# Altium schematic sheet RPi_SyncInputAdapter_Schematic.SchDoc
size A; Organization: Altium Limited; Address1: L3, 12a Rodborough Rd; Address2: Frenchs Forest; Address3: NSW; Address4: Australia 2086
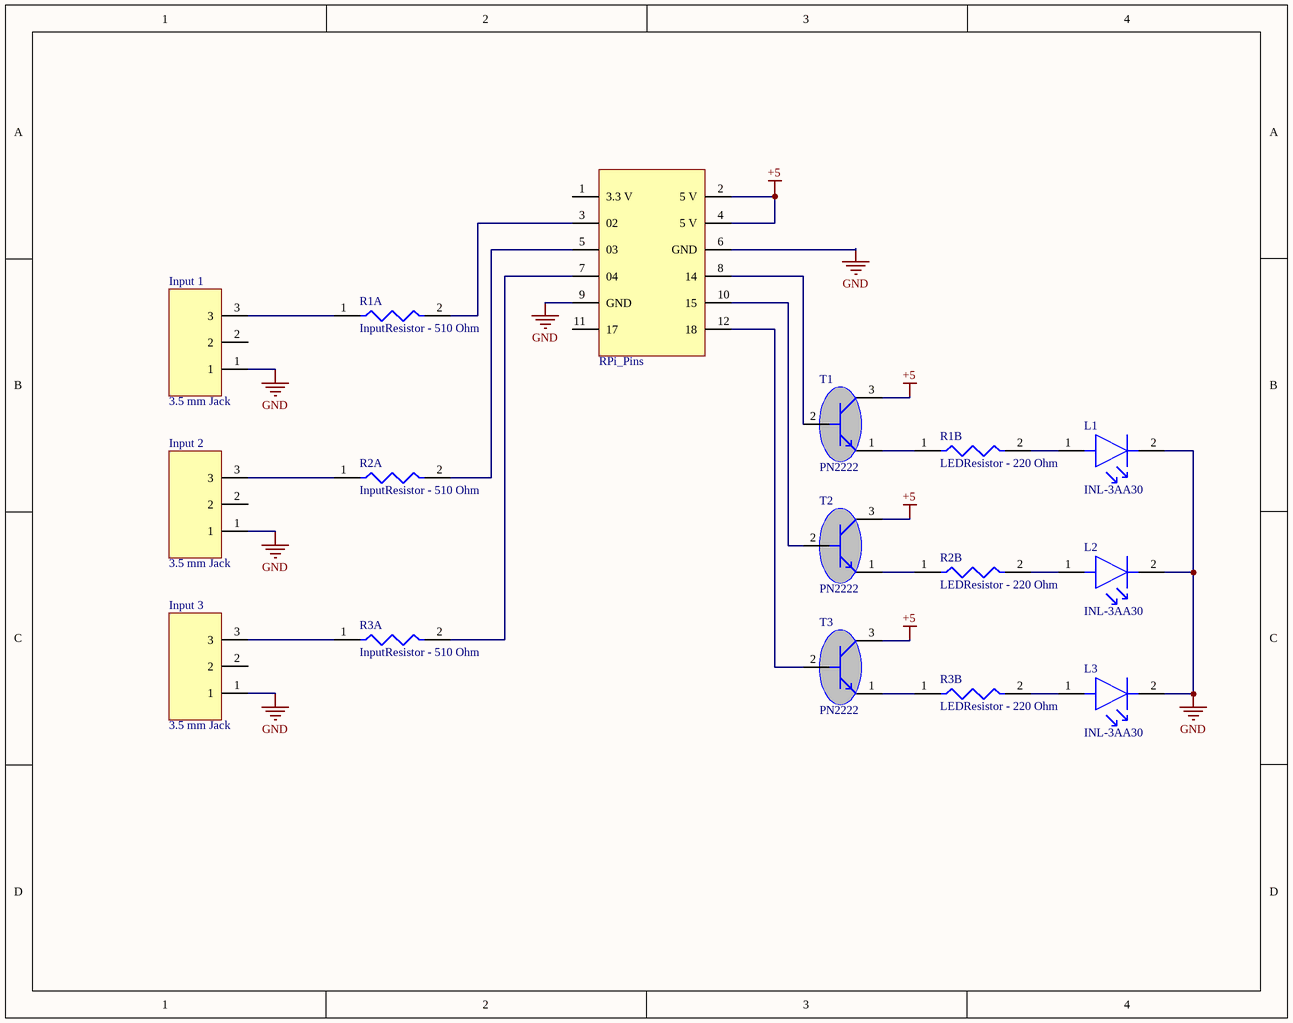
[diagram p0: RPi_SyncInputAdapter_Schematic.SchDoc]

## Parts
*  RPi_Pins  [RPi_Interface]
Input_1  3.5 mm Jack  [3PolesAudioJack_SMD]
Input_2  3.5 mm Jack  [3PolesAudioJack_SMD]
Input_3  3.5 mm Jack  [3PolesAudioJack_SMD]
L1  INL-3AA30  [LED]
L2  INL-3AA30  [LED]
L3  INL-3AA30  [LED]
R1A  InputResistor - 510 Ohm  [TypicalResistor]
R1B  LEDResistor - 220 Ohm  [TypicalResistor]
R2A  InputResistor - 510 Ohm  [TypicalResistor]
R2B  LEDResistor - 220 Ohm  [TypicalResistor]
R3A  InputResistor - 510 Ohm  [TypicalResistor]
R3B  LEDResistor - 220 Ohm  [TypicalResistor]
T1  PN2222  [PN2222_Transistor]
T2  PN2222  [PN2222_Transistor]
T3  PN2222  [PN2222_Transistor]

## Nets
+5: *.2(5_V) *.4(5_V) T1.3 T2.3 T3.3
GND: *.6(GND) *.9(GND) Input_1.1 Input_2.1 Input_3.1 L1.2 L2.2 L3.2
Net*_3: *.3(02) R1A.2
Net*_5: *.5(03) R2A.2
Net*_7: *.7(04) R3A.2
Net*_8: *.8(14) T1.2
Net*_10: *.10(15) T2.2
Net*_12: *.12(18) T3.2
NetInput_1_3: Input_1.3 R1A.1
NetInput_2_3: Input_2.3 R2A.1
NetInput_3_3: Input_3.3 R3A.1
NetL1_1: L1.1 R1B.2
NetL2_1: L2.1 R2B.2
NetL3_1: L3.1 R3B.2
NetR1B_1: R1B.1 T1.1
NetR2B_1: R2B.1 T2.1
NetR3B_1: R3B.1 T3.1

Not connected (* = marked no-connect by the designer): * 1(3.3_V) 11(17); Input_1 2; Input_2 2; Input_3 2

## Notes on the sheet
- Title
- Size:
- Date:
- A
- Number:
- Time:
- Revision:
- Sheet
- of
- File:

## Library data of the parts
Input_1-Input_3 = SJ-3523-SMT-TR: CONN JACK STEREO 3.5MM SMD R/A; Manufacturer: CUI; Gender: Female; Shielding: Unshielded; Current Rating: 1A; Number of Conductors: 3; Number of Ports: 1; Voltage Rating: 12V; Supplier 1: Digi-Key; Supplier Part Number 1: CP-3523SJDKR-ND; Manufacturer Part Number: SJ-3523-SMT-TR; Stock 1: 63484; Pricing 1: 1=0.94, 10=0.827, 25=0.778, 50=0.7456, 100=0.7133, 250=0.6484, 500=0.58358 (USD); Mount: Surface Mount; Contact Plating: Silver; Contact Material: Copper Alloy; Color: Black; Housing Material: Polyamide; Weight: 0.037038oz; Packaging: Cut Tape; Termination: SMD/SMT; Package Quantity: 1000; Connector Type: Jack; Orientation: Horizontal; Number of Positions: 3; Lead Free: Lead Free; ComponentLink1URL: https://www.digikey.com/en/products/detail/cui-devices/SJ-3523-SMT-TR/669704; ComponentLink1Description: https://www.digikey.com/en/products/detail/cui-devices/SJ-3523-SMT-TR/669704
L1-L3 = INL-3AA30: LED AMBER CLEAR 3MM T/H; Manufacturer: Inolux; Color: Orange; Lens Color: Colorless; Lens Style: Round,Domed; Luminous Intensity: 460mcd; Forward Voltage: 2V; Test Current: 20mA; Viewing Angle: 30°; Dominant Wavelength: 610nm; Supplier 1: Digi-Key; Supplier Part Number 1: 1830-1001-ND; Manufacturer Part Number: INL-3AA30; Stock 1: 1251; Pricing 1: 1=0.32, 10=0.256, 100=0.115, 500=0.10388, 1000=0.08533, 2000=0.0742, 5000=0.06678, 10000=0.05936, 25000=0.05565 (USD); Mount: Through Hole; Case/Package: Radial; Packaging: Bulk; Lens Transparency: Clear; Height: 5.08mm; Lens Size: 3mm; ComponentLink1URL: http://www.inolux-corp.com/datasheet/Display/Through-Hole-Display/Round-Lamp/INL-3AX30%20series.pdf?src-supplier=Digi-Key; ComponentLink1Description: http://www.inolux-corp.com/datasheet/Display/Through-Hole-Display/Round-Lamp/INL-3AX30%20series.pdf?src-supplier=Digi-Key
R1A R2A R3A = InputResistor
R1B R2B R3B = LEDResistor
T1-T3 = PN2222: TRANS NPN 30V 0.6A TO92; Manufacturer: ON Semiconductor / Fairchild; hFE Min: 35; Max Power Dissipation: 625mW; Collector Base Voltage (VCBO): 60V; Emitter Base Voltage (VEBO): 5V; Max Collector Current: 600mA; Element Configuration: Single; Gain Bandwidth Product: 250MHz; Collector Emitter Saturation Voltage: 1.6V; Number of Elements: 1; Supplier 1: Digi-Key; Supplier Part Number 1: PN2222OS-ND; Manufacturer Part Number: PN2222; Stock 1: 0; Mount: Through Hole; Case/Package: TO-92-3; Number of Pins: 3; Min Operating Temperature: -55°C; Max Operating Temperature: 150°C; Polarity: NPN; Collector Emitter Voltage (VCEO): 30V; Packaging: Bulk; Package Quantity: 5000; Power Dissipation: 625mW; Frequency: 250MHz; Collector Emitter Breakdown Voltage: 30V; Transition Frequency: 250MHz; Collector-emitter Voltage-Max: 1.6V; Series: -; RoHS Compliant: No; ComponentLink1URL: http://www.onsemi.com/pub/Collateral/PN2222-D.PDF?src-supplier=Digi-Key; ComponentLink1Description: http://www.onsemi.com/pub/Collateral/PN2222-D.PDF?src-supplier=Digi-Key